# EAGLE schematic rasbperryPI (EAGLE 8.3.1)
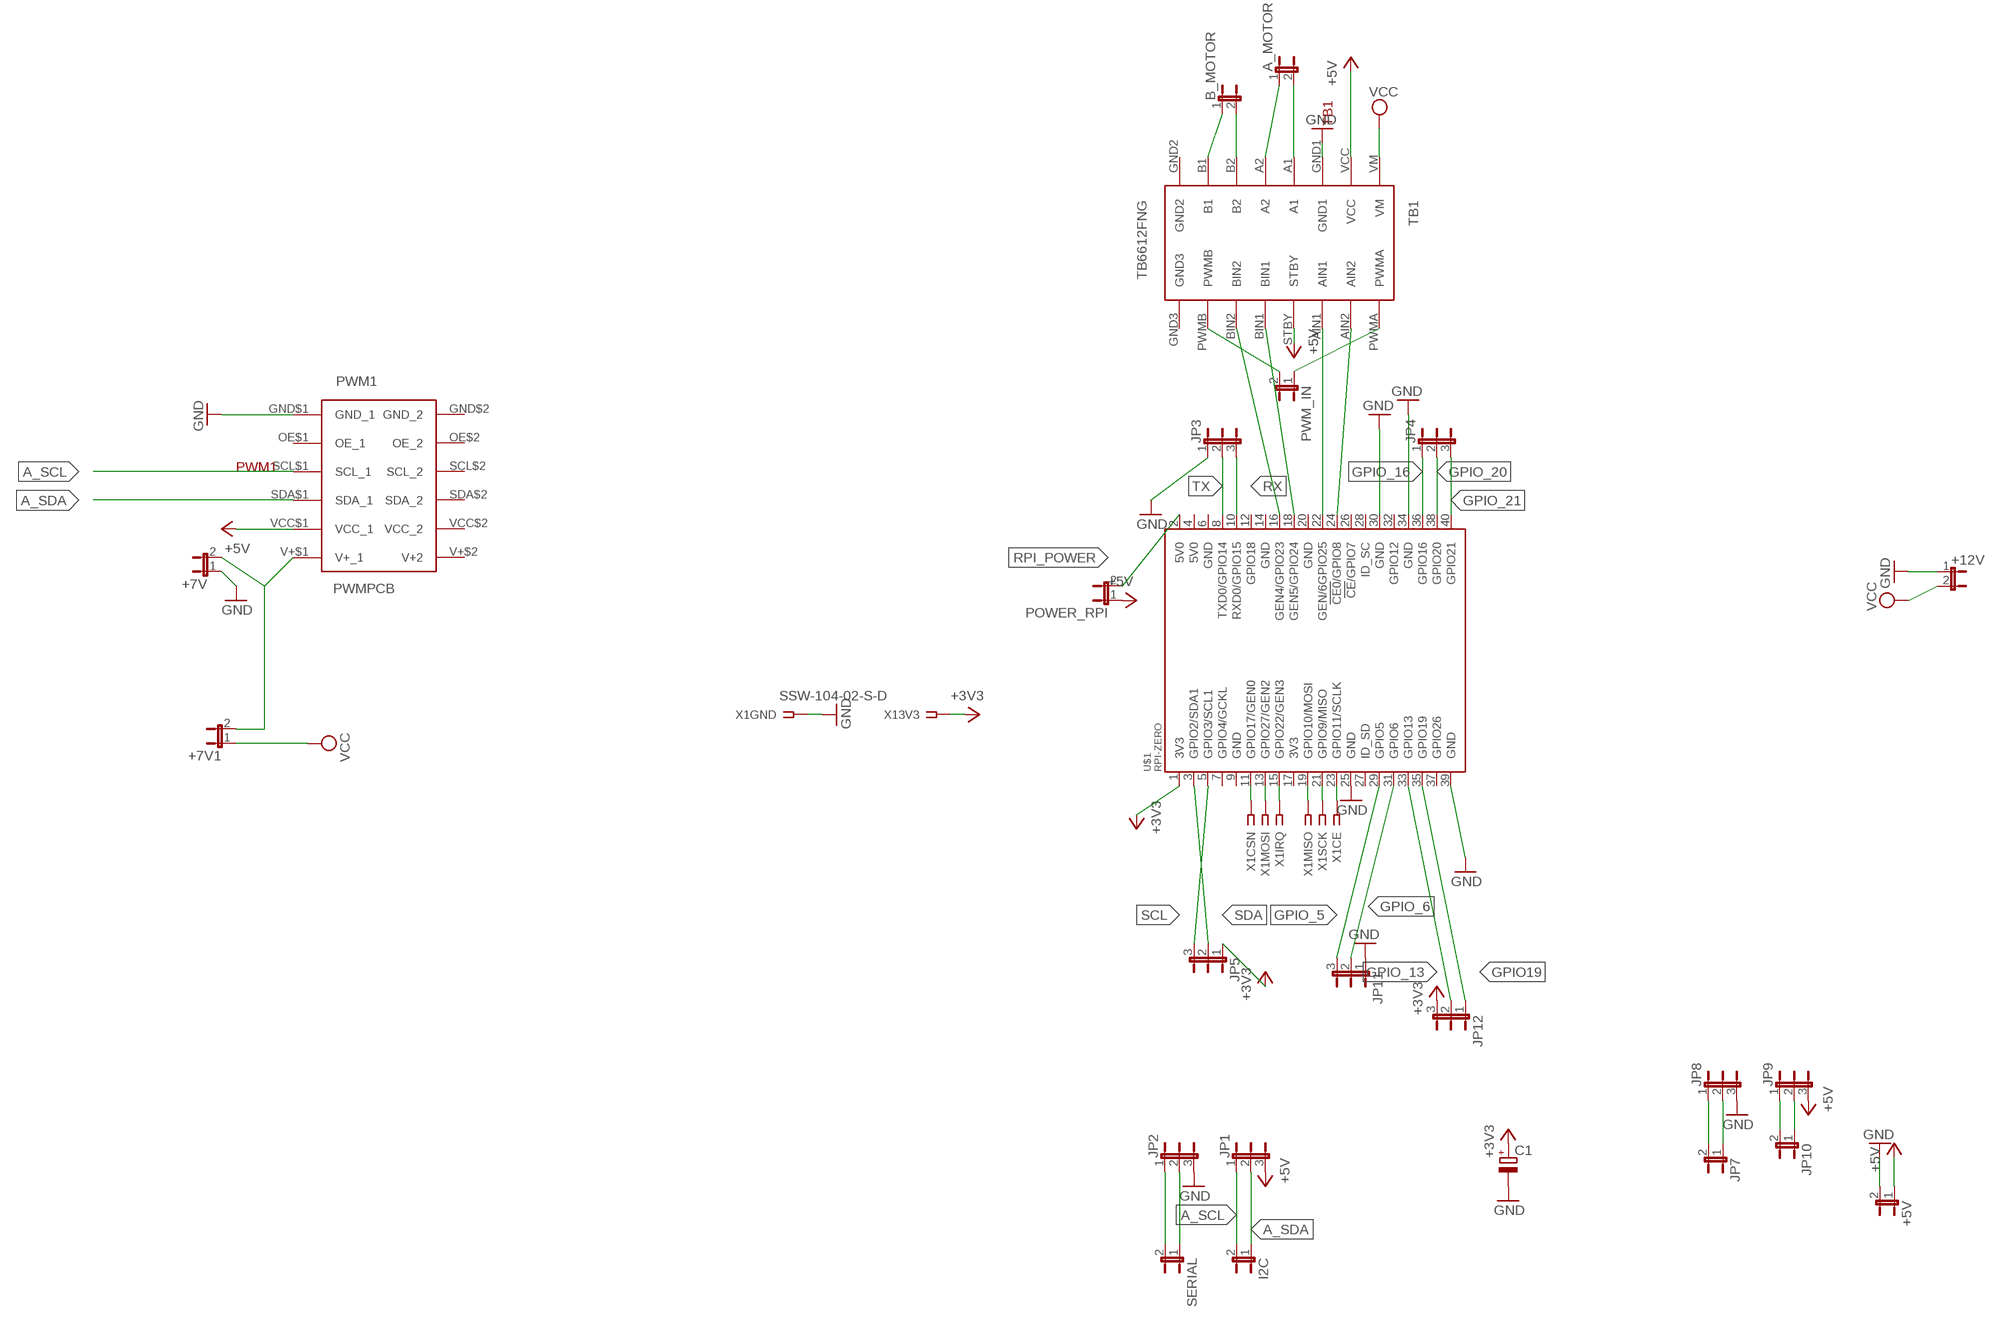
[diagram p0: schematic, sheet 1]

## Parts
+5V  JP1E  [JP1]
+7V  JP1E  [JP1]
+7V1  JP1E  [JP1]
+12V  JP1E  [JP1]
A_MOTOR  JP1E  [JP1]
B_MOTOR  JP1E  [JP1]
C1  CPOL-EUE2,5-6E  [E2,5-6E]
I2C  JP1E  [JP1]
JP1  JP2E  [JP2]
JP2  JP2E  [JP2]
JP3  JP2E  [JP2]
JP4  JP2E  [JP2]
JP5  JP2E  [JP2]
JP7  JP1E  [JP1]
JP8  JP2E  [JP2]
JP9  JP2E  [JP2]
JP10  JP1E  [JP1]
JP11  JP2E  [JP2]
JP12  JP2E  [JP2]
POWER_RPI  JP1E  [JP1]
PWM1  PWMPCB  [PWM]
PWM_IN  JP1E  [JP1]
SERIAL  JP1E  [JP1]
TB1  TB6612FNG  [TB6612FNG]
U$1  RPI-ZERO  [RASP_PI_ZERO_BOARD_FULL]
X1  SSW-104-02-S-D  [SSW-104-02-S-D]

## Nets
+3V3: C1.+ JP5.1 JP12.3 U$1.1(3V3) X1.2
+5V: +5V.1 JP1.3 JP9.3 POWER_RPI.1 PWM1.VCC$1(VCC_1) TB1.STBY TB1.VCC
A_SCL: I2C.2 JP1.1 PWM1.SCL$1(SCL_1)
A_SDA: I2C.1 JP1.2 PWM1.SDA$1(SDA_1)
GND: +5V.2 +7V.1 +12V.1 C1.- JP2.3 JP3.1 JP8.3 JP11.1 PWM1.GND$1(GND_1) TB1.GND1 U$1.25(GND) U$1.30(GND) U$1.34(GND) U$1.39(GND) X1.1
GPIO19: JP12.1 U$1.35(GPIO19)
GPIO_5: JP11.3 U$1.29(GPIO5)
GPIO_6: JP11.2 U$1.31(GPIO6)
GPIO_13: JP12.2 U$1.33(GPIO13)
GPIO_16: JP4.1 U$1.36(GPIO16)
GPIO_20: JP4.2 U$1.38(GPIO20)
GPIO_21: JP4.3 U$1.40(GPIO21)
N$1: +7V1.2 +7V.2 PWM1.V+$1(V+_1)
N$3: U$1.11(GPIO17/GEN0) X1.4
N$4: U$1.13(GPIO27/GEN2) X1.6
N$5: U$1.15(GPIO22/GEN3) X1.8
N$6: U$1.19(GPIO10/MOSI) X1.7
N$7: U$1.21(GPIO9/MISO) X1.5
N$8: U$1.23(GPIO11/SCLK) X1.3
N$11: PWM_IN.1 TB1.PWMA
N$12: PWM_IN.2 TB1.PWMB
N$17: B_MOTOR.1 TB1.B1
N$18: B_MOTOR.2 TB1.B2
N$19: A_MOTOR.1 TB1.A2
N$20: A_MOTOR.2 TB1.A1
N$21: JP2.1 SERIAL.2
N$22: JP2.2 SERIAL.1
N$23: TB1.BIN2 U$1.16(GEN4/GPIO23)
N$24: TB1.BIN1 U$1.18(GEN5/GPIO24)
N$25: TB1.AIN1 U$1.22(GEN/6GPIO25)
N$26: TB1.AIN2 U$1.24(!CE0!/GPIO8)
N$27: JP7.2 JP8.1
N$28: JP7.1 JP8.2
N$29: JP9.1 JP10.2
N$30: JP9.2 JP10.1
RPI_POWER: POWER_RPI.2 U$1.2(5V0)
RX: JP3.3 U$1.10(RXD0/GPIO15)
SCL: JP5.3 U$1.5(GPIO3/SCL1)
SDA: JP5.2 U$1.3(GPIO2/SDA1)
TX: JP3.2 U$1.8(TXD0/GPIO14)
VCC: +7V1.1 +12V.2 TB1.VM
Unconnected: PWM1.GND$2(GND_2) PWM1.OE$1(OE_1) PWM1.OE$2(OE_2) PWM1.SCL$2(SCL_2) PWM1.SDA$2(SDA_2) PWM1.V+$2(V+2) PWM1.VCC$2(VCC_2) TB1.GND2 TB1.GND3 U$1.4(5V0) U$1.6(GND) U$1.7(GPIO4/GCKL) U$1.9(GND) U$1.12(GPIO18) U$1.14(GND) U$1.17(3V3) U$1.20(GND) U$1.26(!CE!/GPIO7) U$1.27(ID_SD) U$1.28(ID_SC) U$1.32(GPIO12) U$1.37(GPIO26)

## Library data of the parts
+5V +7V +7V1 +12V A_MOTOR B_MOTOR I2C JP7 JP10 POWER_RPI PWM_IN SERIAL = jumper:JP1E: JUMPER
C1 = rcl:CPOL-EU: POLARIZED CAPACITOR, European symbol
JP1-JP5 JP8 JP9 JP11 JP12 = jumper:JP2E: JUMPER
PWM1 = PWM_I2C:PWM: PWM I2C
TB1 = TB6612FNG:TB6612FNG
U$1 = RPI-Zero:RPI-ZERO
X1 = Sajdak:SSW-104-02-S-D: THROUGH-HOLE .025" SQ POST SOCKET Source: Samtec SSW.pdf; NRF24L01: nrf24l01; OC_FARNELL: 1668346; OC_NEWARK: 11P9382